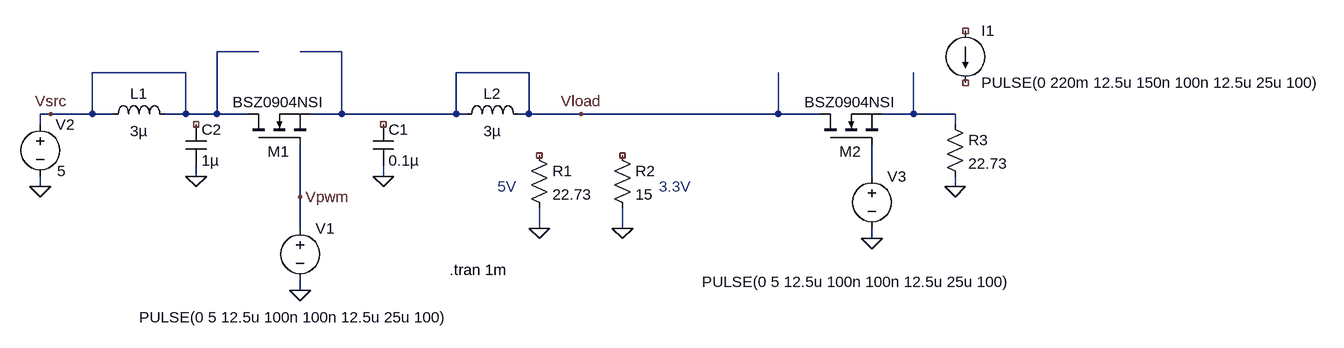
[diagram p0: schematic switcher-ripple.asc]
switcher-ripple.asc, the LTspice schematic file:
Version 4
SHEET 1 1628 680
WIRE -48 32 -112 32
WIRE 80 32 16 32
WIRE -160 64 -304 64
WIRE 368 64 256 64
WIRE -368 128 -384 128
WIRE -304 128 -304 64
WIRE -304 128 -368 128
WIRE -272 128 -304 128
WIRE -160 128 -160 64
WIRE -160 128 -192 128
WIRE -112 128 -112 32
WIRE -112 128 -160 128
WIRE -64 128 -112 128
WIRE 80 128 80 32
WIRE 80 128 32 128
WIRE 256 128 256 64
WIRE 256 128 80 128
WIRE 272 128 256 128
WIRE 368 128 368 64
WIRE 368 128 352 128
WIRE 448 128 368 128
WIRE 752 128 752 64
WIRE 752 128 448 128
WIRE 816 128 752 128
WIRE 960 128 960 64
WIRE 960 128 912 128
WIRE 1024 128 960 128
WIRE -384 144 -384 128
WIRE 1024 144 1024 128
WIRE -144 224 -144 208
WIRE 144 224 144 208
WIRE 896 224 896 176
WIRE -384 240 -384 224
WIRE 1024 240 1024 224
WIRE 16 256 16 176
WIRE 16 304 16 256
WIRE 384 304 384 272
WIRE 512 304 512 272
WIRE 896 320 896 304
WIRE 16 400 16 384
FLAG 16 400 0
FLAG -384 240 0
FLAG 384 304 0
FLAG 512 304 0
FLAG 448 128 Vload
FLAG -368 128 Vsrc
FLAG 16 256 Vpwm
FLAG 144 224 0
FLAG -144 224 0
FLAG 896 320 0
FLAG 1024 240 0
SYMBOL nmos -64 176 R270
WINDOW 0 -10 30 VRight 2
WINDOW 3 66 -24 VRight 2
SYMATTR InstName M1
SYMATTR Value BSZ0904NSI
SYMBOL voltage 16 288 R0
WINDOW 3 -248 153 Left 2
WINDOW 123 0 0 Left 0
WINDOW 39 0 0 Left 0
SYMATTR InstName V1
SYMATTR Value PULSE(0 5 12.5u 100n 100n 12.5u 25u 100)
SYMBOL voltage -384 128 R0
WINDOW 3 26 88 Left 2
WINDOW 123 0 0 Left 0
WINDOW 39 0 0 Left 0
SYMATTR InstName V2
SYMATTR Value 5
SYMBOL res 368 176 R0
SYMATTR InstName R1
SYMATTR Value 22.73
SYMBOL res 496 176 R0
SYMATTR InstName R2
SYMATTR Value 15
SYMBOL cap 128 144 R0
SYMATTR InstName C1
SYMATTR Value 0.1µ
SYMBOL cap -160 144 R0
SYMATTR InstName C2
SYMATTR Value 1µ
SYMBOL ind -288 144 R270
WINDOW 0 32 56 VTop 2
WINDOW 3 5 56 VBottom 2
SYMATTR InstName L1
SYMATTR Value 3µ
SYMATTR SpiceLine Ipk=1 Rser=88m Rpar=750 Cpar=500f
SYMBOL ind 256 144 R270
WINDOW 0 32 56 VTop 2
WINDOW 3 5 56 VBottom 2
SYMATTR InstName L2
SYMATTR Value 3µ
SYMATTR SpiceLine Ipk=1 Rser=88m Rpar=750 Cpar=500f
SYMBOL voltage 896 208 R0
WINDOW 3 -262 179 Left 2
WINDOW 123 0 0 Left 0
WINDOW 39 0 0 Left 0
SYMATTR InstName V3
SYMATTR Value PULSE(0 5 12.5u 100n 100n 12.5u 25u 100)
SYMBOL nmos 816 176 R270
WINDOW 0 -10 30 VRight 2
WINDOW 3 66 -24 VRight 2
SYMATTR InstName M2
SYMATTR Value BSZ0904NSI
SYMBOL current 1040 0 R0
WINDOW 123 0 0 Left 0
WINDOW 39 0 0 Left 0
SYMATTR InstName I1
SYMATTR Value PULSE(0 220m 12.5u 150n 100n 12.5u 25u 100)
SYMBOL res 1008 128 R0
SYMATTR InstName R3
SYMATTR Value 22.73
TEXT 246 368 Left 2 !.tran 1m
TEXT 568 240 Left 2 ;3.3V
TEXT 320 240 Left 2 ;5V

The netlist it stands for:
* switcher-ripple.asc
M1 Vsrc Vpwm Vload Vload BSZ0904NSI
V1 Vpwm 0 PULSE(0 5 12.5u 100n 100n 12.5u 25u 100)
V2 Vsrc 0 5
R1 NC_01 0 22.73
R2 NC_02 0 15
C1 NC_03 0 0.1µ
C2 NC_04 0 1µ
L1 Vsrc Vsrc 3µ Ipk=1 Rser=88m Rpar=750 Cpar=500f
L2 Vload Vload 3µ Ipk=1 Rser=88m Rpar=750 Cpar=500f
V3 N002 0 PULSE(0 5 12.5u 100n 100n 12.5u 25u 100)
M2 Vload N002 N001 N001 BSZ0904NSI
I1 NC_05 NC_06 PULSE(0 220m 12.5u 150n 100n 12.5u 25u 100)
R3 N001 0 22.73
.model NMOS NMOS
.model PMOS PMOS
.lib standard.mos
.tran 1m
* 3.3V
* 5V
.backanno
.end